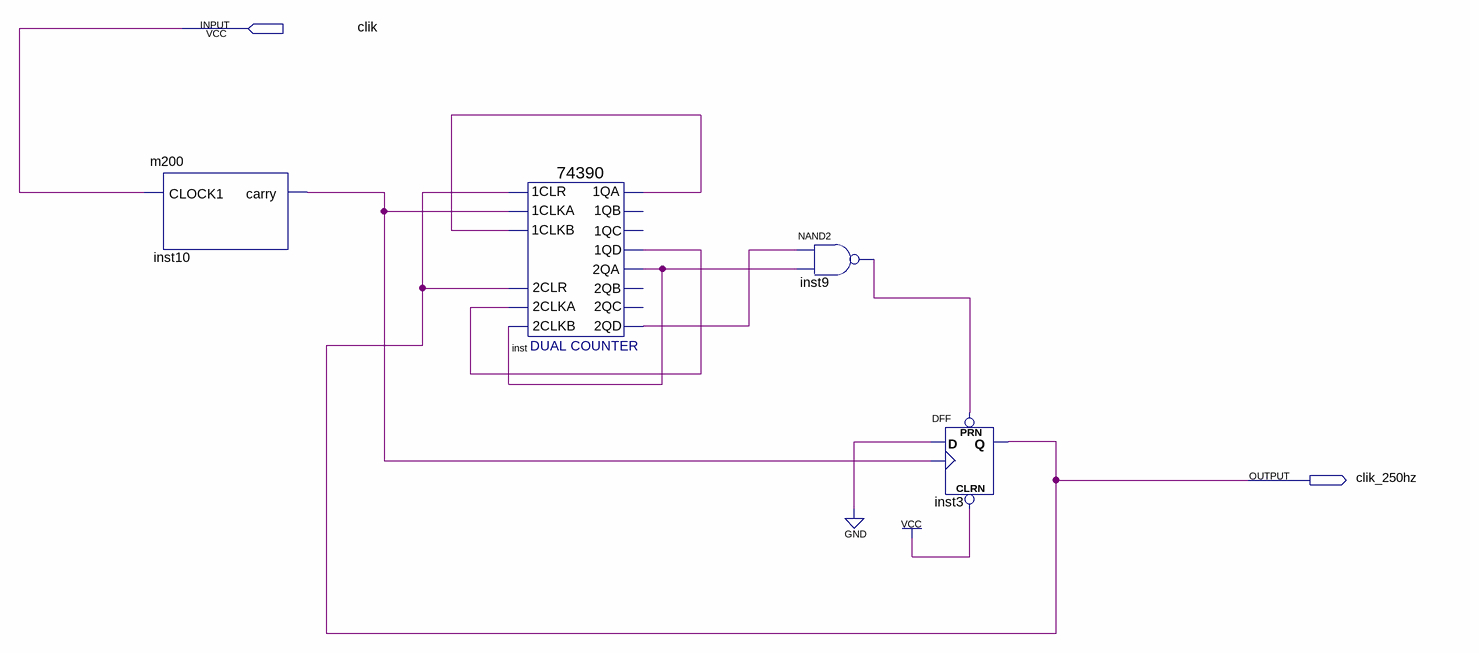
[diagram p0: schematic sheet]
// Quartus schematic Do.bdf as structural Verilog: 4 symbols, 2 pins
module Do (
  input  clik,
  output clik_250hz
);

  wire inst9_out, inst10_carry, inst_1qa, inst_1qd, inst_2qa, inst_2qd;

  m200 inst10 (.CLOCK1(clik), .carry(inst10_carry));
  \74390  inst (
    .\2CLKA (inst_1qd), .\2CLR (clik_250hz), .\2CLKB (inst_2qa), .\1CLR (clik_250hz), .\1CLKA (inst10_carry),
    .\1CLKB (inst_1qa), .\1QA (inst_1qa), .\1QD (inst_1qd), .\2QA (inst_2qa), .\2QD (inst_2qd));  // open: 1QB, 1QC, 2QB, 2QC
  nand inst9 (inst9_out, inst_2qd, inst_2qa);
  DFF inst3 (.CLRN(1'b1), .CLK(inst10_carry), .D(1'b0), .PRN(inst9_out), .Q(clik_250hz));
endmodule
